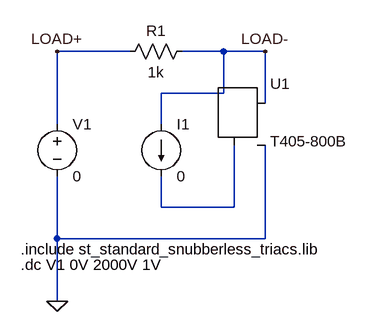
[diagram p0: schematic 3EEC_VELASCO_EXPT6_CKT3.asc]
3EEC_VELASCO_EXPT6_CKT3.asc, the LTspice schematic file:
Version 4
SHEET 1 880 680
WIRE 208 64 96 64
WIRE 352 64 288 64
WIRE 416 64 352 64
WIRE 352 128 352 64
WIRE 352 128 256 128
WIRE 416 144 416 64
WIRE 96 176 96 64
WIRE 256 176 256 128
WIRE 256 304 256 256
WIRE 368 304 368 208
WIRE 368 304 256 304
WIRE 96 352 96 256
WIRE 416 352 416 208
WIRE 416 352 96 352
WIRE 96 448 96 352
FLAG 96 64 LOAD+
FLAG 416 64 LOAD-
FLAG 96 448 0
SYMBOL Misc\\TRIAC 384 144 R0
SYMATTR InstName U1
SYMATTR Value T405-800B
SYMBOL res 304 48 R90
WINDOW 0 0 56 VBottom 2
WINDOW 3 32 56 VTop 2
SYMATTR InstName R1
SYMATTR Value 1k
SYMBOL voltage 96 160 R0
SYMATTR InstName V1
SYMATTR Value 0
SYMBOL current 256 176 R0
SYMATTR InstName I1
SYMATTR Value 0
TEXT 40 368 Left 2 !.include st_standard_snubberless_triacs.lib
TEXT 40 392 Left 2 !.dc V1 0V 2000V 1V

The netlist it stands for:
* 3EEC_VELASCO_EXPT6_CKT3.asc
XU1 LOAD- N001 0 T405-800B  ; pins MT2 G MT1
R1 LOAD- LOAD+ 1k
V1 LOAD+ 0 0
I1 LOAD- N001 0
.include st_standard_snubberless_triacs.lib
.dc V1 0V 2000V 1V
.backanno
.end